# Altium schematic sheet Booster_RF_CH_SUP_CTRL.SchDoc: Booster RF channel
size 420 x 297 mm; Author: G.K.; CompanyName: WUT; DrawnBy: G.K.; Organization: CERN; Address1: Warsaw Univeristy of Technology; Address2: Nowowiejska 15/19; Revision: 1.6.1; SheetNumber: -; SheetTotal: -; EDA_Number: ARTIQ; Projet: ADC/DAC MEZZANINE; ModifiedBy: -; CreateDate: XX/XX/XXXX; CheckedDate: -; Title2: supply & control v1.6; DivGrp: ISE; Designer: G.K.; ModifiedDate: -; ProjectName: ADC/DAC MEZZANINE
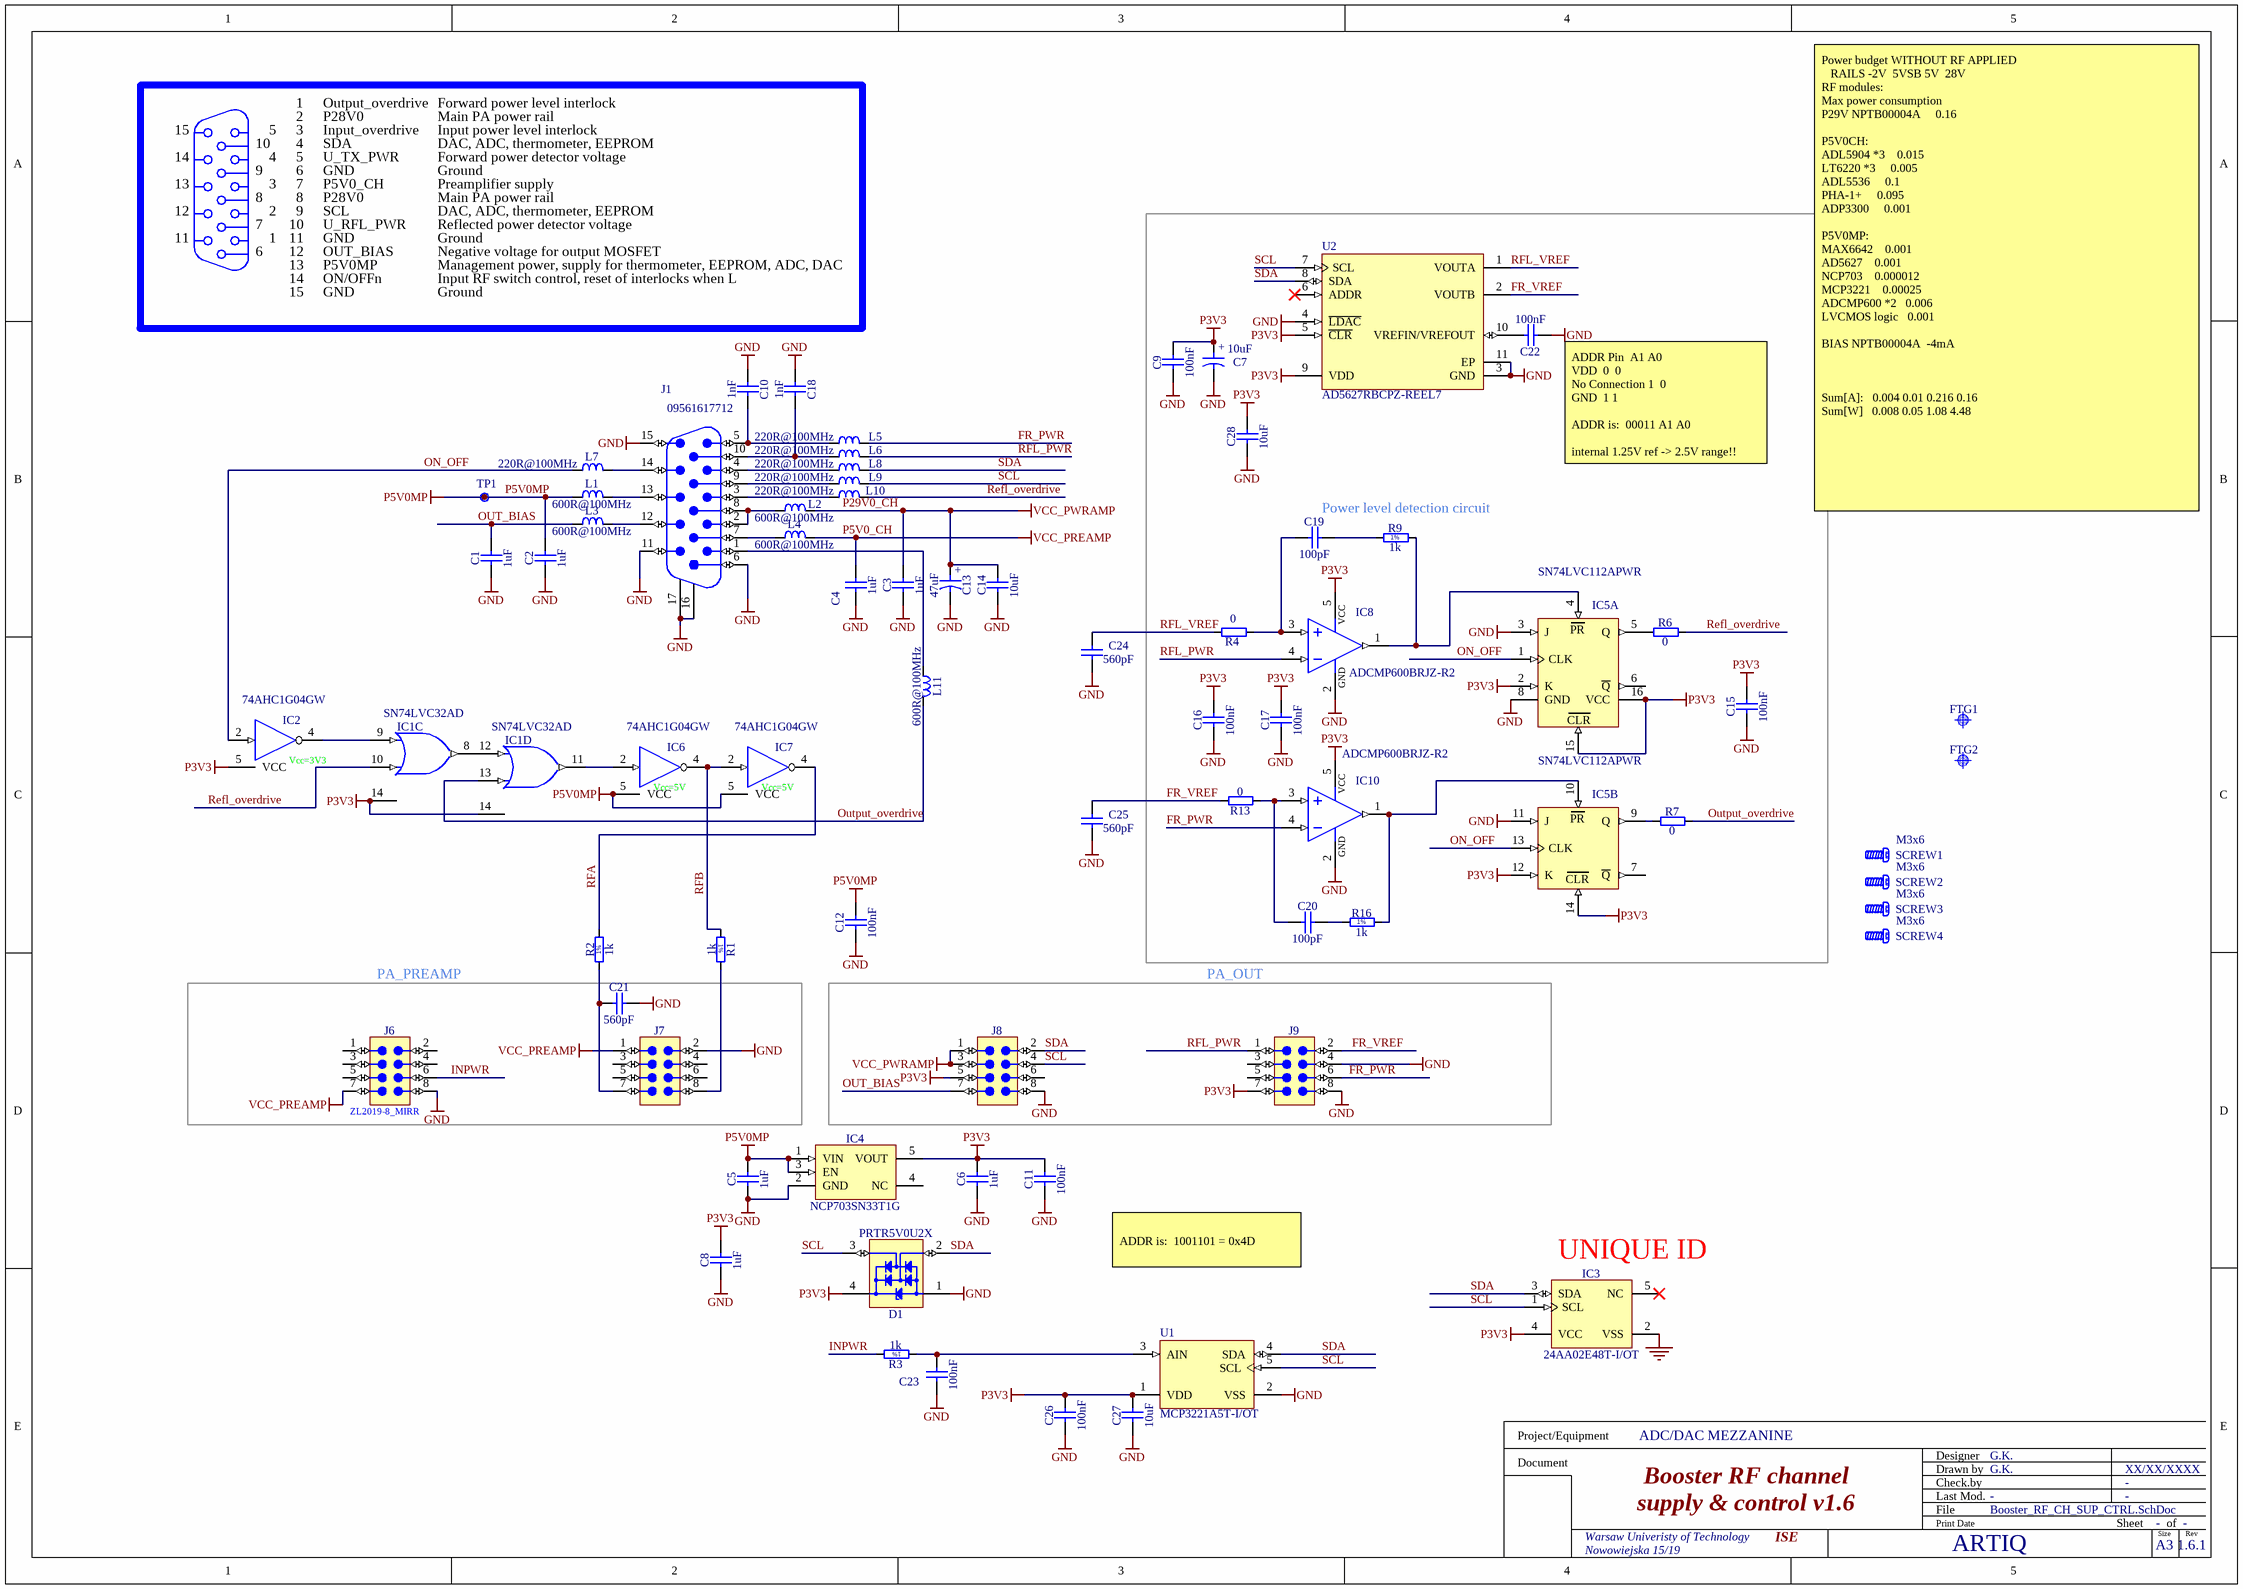
[diagram p0: Booster_RF_CH_SUP_CTRL.SchDoc]

## Parts
C1  1uF  [CAPC2012X110N]
C2  1uF  [CAPC2012X110N]
C3  1uF  [CAPC2012X110N]
C4  1uF  [CAPC2012X110N]
C5  1uF  [CAPC2012X140N]
C6  1uF  [CAPC2012X140N]
C7  10uF  [CAPMP3216X180N]
C8  1uF  [CAPC2012X140N]
C9  100nF  [CAPC1005X55N]
C10  1nF  [CAPC1608X90N]
C11  100nF  [CAPC1005X55N]
C12  100nF  [CAPC1005X55N]
C13  47uF  [CAPMP7343X430N]
C14  10uF  [CAPC3216X190N]
C15  100nF  [CAPC1005X55N]
C16  100nF  [CAPC1005X55N]
C17  100nF  [CAPC1005X55N]
C18  1nF  [CAPC1608X90N]
C19  100pF  [CAPC1005X55N]
C20  100pF  [CAPC1005X55N]
C21  560pF  [CAPC1608X87N]
C22  100nF  [CAPC1005X55N]
C23  100nF  [CAPC1005X55N]
C24  560pF  [CAPC1608X87N]
C25  560pF  [CAPC1608X87N]
C26  100nF  [CAPC1005X55N]
C27  10uF  [CAPC3216X190N]
C28  10uF  [CAPC3216X190N]
D1  PRTR5V0U2X  [SOT190P230X110-4N]
FTG1  Use only in PCB  [FIDUCIAL_TOP_C100-200]  (value not drawn)  (no BOM)
FTG2  Use only in PCB  [FIDUCIAL_TOP_S100-200]  (value not drawn)  (no BOM)
IC1  SN74LVC32AD  [SOIC127P600X175-14N]  (parts C,D of 4)
IC2  74AHC1G04GW  [SOT65P212X110-5N]
IC3  24AA02E48T-I/OT  [SOT95P280X145-5N]
IC4  NCP703SN33T1G  [SOT95P275X110-5N]
IC5  SN74LVC112APWR  [SOP65P640X120-16N]  (parts A,B of 2)
IC6  74AHC1G04GW  [SOT65P212X110-5N]
IC7  74AHC1G04GW  [SOT65P212X110-5N]
IC8  ADCMP600BRJZ-R2  [SOT95P280X145-5N]
IC10  ADCMP600BRJZ-R2  [SOT95P280X145-5N]
J1  Manufacturer Part Number: 09561617712  [TYCO_5750489-1]  (hidden comment: HD-Sub)
J6  Header 8  [ZL2019-8_MIRR]  (value not drawn)
J7  Header 8  [ZL2019-8_MIRR]  (value not drawn)
J8  Header 8  [ZL2019-8_MIRR]  (value not drawn)
J9  Header 8  [ZL2019-8_MIRR]  (value not drawn)
L1  600R@100MHz  [INDC3216X130N]
L2  600R@100MHz  [INDC3216X130N]
L3  600R@100MHz  [INDC3216X130N]
L4  600R@100MHz  [INDC3216X130N]
L5  220R@100MHz  [INDC1005X55N]
L6  220R@100MHz  [INDC1005X55N]
L7  220R@100MHz  [INDC1005X55N]
L8  220R@100MHz  [INDC1005X55N]
L9  220R@100MHz  [INDC1005X55N]
L10  220R@100MHz  [INDC1005X55N]
L11  600R@100MHz  [INDC3216X130N]
R1  1k  [RESC1005X40N]
R2  1k  [RESC1005X40N]
R3  1k  [RESC1005X40N]
R4  0  [RESC1005X40N]
R6  0  [RESC1608X55N]
R7  0  [RESC1608X55N]
R9  1k  [RESC1005X40N]
R13  0  [RESC1005X40N]
R16  1k  [RESC1005X40N]
SCREW1  M3x6  [BOSSARD_BN5687-3061605_v]
SCREW2  M3x6  [BOSSARD_BN5687-3061605_v]
SCREW3  M3x6  [BOSSARD_BN5687-3061605_v]
SCREW4  M3x6  [BOSSARD_BN5687-3061605_v]
TP1  Test Point  [TPS127]  (value not drawn)  (no BOM)
U1  MCP3221A5T-I/OT  [SOT-23-OT5_L]
U2  AD5627RBCPZ-REEL7  [CP-10-9_M]

## Blocks framed on the sheet
Power level detection circuit: C7 C9 C15-C17 C19 C20 C22 C28 IC5 IC8 IC10 R4 R6 R7 R9 R13 R16 U2
PA_PREAMP: C21 J6 J7
PA_OUT: J8 J9

## Nets
GND: C1.1 C2.1 C3.1 C4.1 C5.1 C6.1 C7.2 C8.1 C9.1 C10.1 C11.1 C12.1 C13.2 C14.1 C15.1 C16.1 C17.1 C18.1 C21.2 C22.1 C23.1 C24.2 C25.2 C26.1 C27.1 C28.1 D1.1(GND) IC1.7(GND) IC2.3(GND) IC3.2(VSS) IC4.2(GND) IC5.3(J) IC5.8(GND) IC5.11(J) IC6.3(GND) IC7.3(GND) IC8.2(GND) IC10.2(GND) J1.6 J1.11 J1.15 J1.16 J1.17 J6.8 J7.2 J8.8 J9.4 J9.8 U1.2(VSS) U2.3(GND) U2.4(~{LDAC}) U2.11(EP)
P3V3: C6.2 C7.1 C8.2 C9.2 C11.2 C15.2 C16.2 C17.2 C26.2 C27.2 C28.2 D1.4(VCC) IC1.14(VCC) IC2.5(VCC) IC3.4(VCC) IC4.5(VOUT) IC5.2(K) IC5.12(K) IC5.14(~{CLR}) IC5.15(~{CLR}) IC5.16(VCC) IC8.5(VCC) IC10.5(VCC) J8.5 J9.7 U1.1(VDD) U2.5(~{CLR}) U2.9(VDD)
P5V0_CH: C4.2 J6.7 J7.1 L4.2  [also labelled VCC_PREAMP]
P5V0MP: C2.2 C5.2 C12.2 IC4.1(VIN) IC4.3(EN) IC6.5(VCC) IC7.5(VCC) L1.1 TP1.1
P29V0_CH: C3.2 C13.1 C14.2 J8.1 J8.3 L2.2  [also labelled VCC_PWRAMP]
FR_PWR: IC10.4(VN) J9.6 L5.2
FR_VREF: C25.1 J9.2 R13.2 U2.2(VOUTB)
INPWR: J6.6 R3.2
ON_OFF: IC2.2(IN) IC5.1(CLK) IC5.13(CLK) L7.1
OUT_BIAS: C1.2 J8.7 L3.1
Output_overdrive: IC1.13(B) L11.2 R7.2
Refl_overdrive: IC1.10(B) L10.2 R6.2
RFA: IC7.4(OUT) R2.2
RFB: IC6.4(OUT) IC7.2(IN) R1.1
RFL_PWR: IC8.4(VN) J9.1 L6.2
RFL_VREF: C24.1 R4.2 U2.1(VOUTA)
SCL: D1.3(I/O2) IC3.1(SCL) J8.4 L9.2 U1.5(SCL) U2.7(SCL)
SDA: D1.2(I/O1) IC3.3(SDA) J8.2 L8.2 U1.4(SDA) U2.8(SDA)
NetC10_2: C10.2 J1.5 L5.1
NetC18_2: C18.2 J1.10 L6.1
NetC19_1: C19.1 IC8.3(VP) R4.1
NetC19_2: C19.2 R9.1
NetC20_1: C20.1 IC10.3(VP) R13.1
NetC20_2: C20.2 R16.1
NetC21_1: C21.1 J7.7 R2.1
NetC22_2: C22.2 U2.10(VREFIN/VREFOUT)
NetC23_2: C23.2 R3.1 U1.3(AIN)
NetIC1_8: IC1.8(Y) IC1.12(A)
NetIC1_9: IC1.9(A) IC2.4(OUT)
NetIC1_11: IC1.11(Y) IC6.2(IN)
NetIC5_4: IC5.4(~{PRE}) IC8.1(q) R9.2
NetIC5_5: IC5.5(Q) R6.1
NetIC5_9: IC5.9(Q) R7.1
NetIC5_10: IC5.10(~{PRE}) IC10.1(q) R16.2
NetJ1_1: J1.1 L11.1
NetJ1_2: J1.2 J1.8 L2.1
NetJ1_3: J1.3 L10.1
NetJ1_4: J1.4 L8.1
NetJ1_7: J1.7 L4.1
NetJ1_9: J1.9 L9.1
NetJ1_12: J1.12 L3.2
NetJ1_13: J1.13 L1.2
NetJ1_14: J1.14 L7.2
NetJ7_8: J7.8 R1.2

Not connected (* = marked no-connect by the designer): IC3 5(NC)*; IC4 4(NC); IC5 6(~{Q}) 7(~{Q}); J6 1 2 3 4 5; J7 3 4 5 6; J8 6; J9 3 5; U2 6(ADDR)*

## Notes on the sheet
- 1
- 2
- Output_overdrive
- P28V0
- Forward power level interlock
- Main PA power rail
- 13
- 14
- 15
- 9
- 10
- 3
- 4
- 5
- 6
- 7
- Input_overdrive
- SDA
- U_TX_PWR
- GND
- P5V0_CH
- Input power level interlock
- DAC, ADC, thermometer, EEPROM
- Forward power detector voltage
- Preamplifier supply
- Ground
- 11
- 12
- 8
- SCL
- U_RFL_PWR
- OUT_BIAS
- Reflected power detector voltage
- Negative voltage for output MOSFET
- ON/OFFn
- P5V0MP
- Input RF switch control, reset of interlocks when L
- Management power, supply for thermometer, EEPROM, ADC, DAC
- (near C22) ADDR Pin		A1	A0
  VDD		0 	0
  No Connection	1 	0
  GND		1	1
  ADDR is:  00011 A1 A0
  internal 1.25V ref -> 2.5V range!!
- Power budget WITHOUT RF APPLIED
  RAILS	-2V 	5VSB	5V 	28V
  RF modules:
  Max power consumption
  P29V NPTB00004A					0.16
  P5V0CH:
  ADL5904 *3				0.015
  LT6220 *3					0.005
  ADL5536					0.1
  PHA-1+					0.095
  ADP3300					0.001
  P5V0MP:
  MAX6642				0.001
  AD5627				0.001
  NCP703				0.000012
  MCP3221				0.00025
  ADCMP600 *2			0.006
  LVCMOS logic			0.001
  BIAS NPTB00004A		-4mA
  Sum[A]:			0.004	0.01	0.216	0.16
  Sum[W]			0.008	0.05	1.08	4.48
- (near IC2) Vcc=3V3
- (near IC6) Vcc=5V
- (near IC7) Vcc=5V
- (near J6) ZL2019-8_MIRR
- ADDR is:  1001101 = 0x4D
- (near IC3) UNIQUE ID
- Project/Equipment
- Document
- Designer
- Drawn by
- Check.by
- File
- Last Mod.
- Print Date
- Sheet
- Size
- A3
- of
- Rev
- (in symbol 74LVC112APWR, part A) PR; CLR
- (in symbol 74LVC112APWR, part B) PR; CLR
- (in symbol CTE3216-18_10UF_16V_20%_AVX_TCJ) +
- (in symbol CTE7343-43_47UF_35V_10%_LESR0300) +
- (in symbol R0402_1K_1%_0.0625W_100PPM) 1%

## Library data of the parts
C1-C4 = CC0805_1UF_50V_10%_X7R: Non-polarised capacitor; Part Description: SMD Multilayer Chip Ceramic Capacitor; Manufacturer: GENERIC; Manufacturer1 Part Number: C0805C105K5RACTU; Voltage: 50V; TC: X7R; Tolerance: ±10%; Part Number: CC0805_1UF_50V_10%_X7R; Component Kind: Standard; Component Type: Standard; Pin Count: 2; Value: 1uF; Status: Preferred; Manufacturer Part Number: CC0805_1UF_50V_10%_X7R; Case: 0805; Mounted: Yes; Socket: No; SMD: Yes; Sense: No; Manufacturer1 Example: KEMET; Manufacturer1 ComponentHeight: 1.1mm; HelpURL: \\cern.ch\dfs\Applications\Altium\Datasheets\CC0805_X7R_KEMET.pdf; Author: CERN DEM JLC; CreateDate: 04.12.2013; LatestRevisionDate: 04.12.2013
C5 C6 C8 = CC0805_1UF_35V_20%_X7R: Non-polarised capacitor; Part Description: SMD Multilayer Chip Ceramic Capacitor; Manufacturer: GENERIC; Manufacturer1 Part Number: GMK212B7105MG-T; Voltage: 35V; TC: X7R; Tolerance: ±20%; Part Number: CC0805_1UF_35V_20%_X7R; Component Kind: Standard; Component Type: Standard; Pin Count: 2; Value: 1uF; Status: Not Recommended; Manufacturer Part Number: CC0805_1UF_35V_20%_X7R; Case: 0805; Mounted: Yes; Socket: No; SMD: Yes; Sense: No; Manufacturer1 Example: TAIYO YUDEN; Manufacturer1 ComponentHeight: 1.35mm; HelpURL: \\cern.ch\dfs\Applications\Altium\Datasheets\CC0805_X7R_TAIYO-YUDEN_HIGH-VALUE.pdf; Author: CERN DEM JLC; CreateDate: 22.06.2011; LatestRevisionDate: 22.06.2011
C7 = CTE3216-18_10UF_16V_20%_AVX_TCJ: Polarised capacitor; Part Description: ESR 0R200 Tantalum Solid Electrolytic Chip Capacitor with Conductive Polymer Electrode; Manufacturer: AVX; Manufacturer Part Number: TCJA106M016R0200; Voltage: 16V; Tolerance: ±20%; Part Number: CTE3216-18_10UF_16V_20%_AVX_TCJ; Component Kind: Standard; Component Type: Standard; Pin Count: 2; Value: 10uF; Status: Preferred; Case: A; Mounted: Yes; Socket: No; SMD: Yes; Sense: No; ComponentHeight: 1.8mm; HelpURL: \\cern.ch\dfs\Applications\Altium\Datasheets\CTE_AVX_TCJ.pdf; Author: CERN DEM JLC; CreateDate: 29.03.2012; LatestRevisionDate: 29.03.2012
C9 C11 C12 C15-C17 C22 C23 C26 = CC0402_100NF_16V_10%_X5R: Non-polarised capacitor; Part Description: SMD Multilayer Chip Ceramic Capacitor; Manufacturer: GENERIC; Manufacturer1 Part Number: GRM155R61C104KA88D; Voltage: 16V; TC: X5R; Tolerance: ±10%; Part Number: CC0402_100NF_16V_10%_X5R; Component Kind: Standard; Component Type: Standard; Pin Count: 2; Value: 100nF; Status: None; Manufacturer Part Number: CC0402_100NF_16V_10%_X5R; Case: 0402; Mounted: Yes; Socket: No; SMD: Yes; Sense: No; Manufacturer1 Example: MURATA; Manufacturer1 ComponentHeight: 0.55mm; HelpURL: \\cern.ch\dfs\Applications\Altium\Datasheets\CC0402_X5R_MURATA_GRM.pdf; Author: CERN DEM JLC; CreateDate: 10.12.2013; LatestRevisionDate: 10.12.2013
C10 C18 = CC0603_1NF_50V_1%_NP0: Non-polarised capacitor; Part Number: CC0603_1NF_50V_5%_NP0; Part Description: SMD Multilayer Chip Ceramic Capacitor; Manufacturer: GENERIC; Manufacturer1 Part Number: 06035A102FAT2A; Voltage: 50V; TC: C0G/NP0; Tolerance: ±5%; Component Kind: Standard; Component Type: Standard; Pin Count: 2; Value: 1nF; Status: None; Manufacturer Part Number: CC0603_1NF_50V_5%_NP0; Case: 0603; Mounted: Yes; Socket: No; SMD: Yes; Sense: No; Manufacturer1 Example: AVX; Manufacturer1 ComponentHeight: 0.9mm; HelpURL: \\cern.ch\dfs\Applications\Altium\Datasheets\CC0603_C0G_AVX.pdf; Author: CERN DEM JLC; CreateDate: 15/06/2017; LatestRevisionDate: 15/06/2017
C13 = CTE7343-43_47UF_35V_10%_LESR0300: Polarised capacitor; Part Description: ESR 0R3 Solid Tantalum Chip Capacitor; Manufacturer: GENERIC; Manufacturer1 Part Number: T495X476K035ATE300; Voltage: 35V; Tolerance: ±10%; Part Number: CTE7343-43_47UF_35V_10%_LESR0300; Component Kind: Standard; Component Type: Standard; Pin Count: 2; Value: 47uF; Status: Preferred; Manufacturer Part Number: CTE7343-43_47UF_35V_10%_LESR0300; Case: E; Mounted: Yes; Socket: No; SMD: Yes; Sense: No; Manufacturer1 Example: AVX; Manufacturer1 ComponentHeight: 4.3mm; HelpURL: \\cern.ch\dfs\Applications\Altium\Datasheets\CTEB_KEMET_T495.pdf; Author: CERN DEM JLC; CreateDate: 27.05.2013; LatestRevisionDate: 27.05.2013
C14 C27 C28 = CC1206_10UF_50V_10%_X5R_TDK_CGA5L3X5R1H106K160AB: Non-polarised capacitor; Part Description: SMD Multilayer Chip Ceramic Capacitor (Automotive Grade); Manufacturer: TDK; Voltage: 50V; TC: X5R; Tolerance: ±10%; Part Number: CC1206_10UF_50V_10%_X5R_TDK_CGA5L3X5R1H106K160AB; Component Kind: Standard; Component Type: Standard; Pin Count: 2; Value: 10uF; Status: Not Recommended; Manufacturer Part Number: CGA5L3X5R1H106K160AB; Case: 1206; Mounted: Yes; Socket: No; SMD: Yes; Sense: No; ComponentHeight: 1.9mm; HelpURL: \\cern.ch\dfs\Applications\Altium\Datasheets\CC1206_X5R_TDK_CGA.pdf; Author: CERN DEM BC; CreateDate: 29.02.2016; LatestRevisionDate: 13.09.2016
C19 C20 = CC0402_100PF_50V_5%_C0G: Non-polarised capacitor; Part Description: SMD Multilayer Chip Ceramic Capacitor; Manufacturer: GENERIC; Manufacturer1 Part Number: C0402C101J5GACTU; Voltage: 50V; TC: C0G/NP0; Tolerance: ±5%; Part Number: CC0402_100PF_50V_5%_C0G; Component Kind: Standard; Component Type: Standard; Pin Count: 2; Value: 100pF; Status: Preferred; Manufacturer Part Number: CC0402_100PF_50V_5%_C0G; Case: 0402; Mounted: Yes; Socket: No; SMD: Yes; Sense: No; Manufacturer1 Example: KEMET; Manufacturer1 ComponentHeight: 0.55mm; HelpURL: \\cern.ch\dfs\Applications\Altium\Datasheets\CC0805_C0G_KEMET_(Commercial Grade).pdf; Author: CERN DEM JLC; CreateDate: 03.12.2007; LatestRevisionDate: 22.04.2015
C21 C24 C25 = CC0603_560PF_50V_5%_NP0: Non-polarised capacitor; Part Description: SMD Multilayer Chip Ceramic Capacitor; Manufacturer: GENERIC; Manufacturer1 Part Number: 223886715561; Voltage: 50V; TC: C0G/NP0; Tolerance: ±5%; Part Number: CC0603_560PF_50V_5%_NP0; Component Kind: Standard; Component Type: Standard; Pin Count: 2; Value: 560pF; Status: Preferred; Manufacturer Part Number: CC0603_560PF_50V_5%_NP0; Case: 0603; Mounted: Yes; Socket: No; SMD: Yes; Sense: No; Manufacturer1 Example: PHYCOMP; Manufacturer1 ComponentHeight: 0.87mm; HelpURL: \\cern.ch\dfs\Applications\Altium\Datasheets\CC0603_NP0_PHYCOMP.pdf; Author: CERN DEM JLC; CreateDate: 03.12.2007; LatestRevisionDate: 03.12.2007
D1 = PRTR5V0U2X: Ultra Low Capacitance Double Rail-to-Rail ESD Protection Diode; Part Description: Ultra Low Capacitance (1pF) Double Rail-to-Rail ESD Protection Diode (8kV); Manufacturer: NXP SEMICONDUCTORS; Voltage: 5.5V; PressFit: No; Bonding: No; Part Number: PRTR5V0U2X; Component Kind: Standard; Component Type: Standard; Device: PRTR5V0U2X; PackageDescription: SOT143B, SOT, 1.90mm Pitch; 4 Pin, 1.30mm W X 2.90mm L X 1.10mm H body, IPC Medium Density; Manufacturer Part Number: PRTR5V0U2X; Pin Count: 4; Case: SOT143B; Mounted: Yes; Socket: No; SMD: Yes; Sense: No; ComponentHeight: 1.1mm; HelpURL: \\cern.ch\dfs\Applications\Altium\Datasheets\PRTR5V0U2X.pdf; Author: CERN DEM JLC; CreateDate: 22.03.2011; LatestRevisionDate: 22.03.2011
FTG1 = FIDUCIAL_TARGET_C100-200: Fiducial Target; Part Description: Round Fiducial Target, Top Layer, 1.0mm, Top Solder 2.0mm, Keepout =2.0mm; Mounted: No; Part Number: FIDUCIAL_TARGET_C100-200; Component Type: Standard (No BOM); Pin Count: 1; Family: Fiducial; Socket: No; SMD: Yes; Sense: No; Status: None; ComponentHeight: 0mm; HelpURL: Undefined; Author: CERN DEM JLC; CreateDate: 09.02.2010; LatestRevisionDate: 04.04.2012; PackageDescription: Round Fiducial Target, Top Layer, 1.0mm, Top Solder 2.0mm, Keepout =2.0mm
FTG2 = FIDUCIAL_TARGET_S100-200: Fiducial Target; Part Description: Square Fiducial Target, Top Layer, 1.0mm, Top Solder 2.0mm, Keepout =2.0mm; Mounted: No; Part Number: FIDUCIAL_TARGET_S100-200; Component Type: Standard (No BOM); Pin Count: 1; Family: Fiducial; Socket: No; SMD: Yes; Sense: No; Status: None; ComponentHeight: 0mm; HelpURL: Undefined; Author: CERN DEM JLC; CreateDate: 09.02.2010; LatestRevisionDate: 04.04.2012; PackageDescription: Square Fiducial Target, Top Layer, 1.0mm, Top Solder 2.0mm, Keepout =2.0mm
IC1 = SN74LVC32AD: Quad 2-Input OR Gate; Part Description: Quad 2-Input Positive-OR Gate; Manufacturer: TEXAS INSTRUMENTS; PressFit: No; Bonding: No; Part Number: SN74LVC32AD; Component Kind: Standard; Component Type: Standard; Device: SN74LVC32AD; PackageDescription: SOIC 14, Pitch 1.27mm - Body 4x8.75mm, IPC Medium Density; Manufacturer Part Number: SN74LVC32AD; Pin Count: 14; Case: SOIC14; Mounted: Yes; Socket: No; SMD: Yes; Sense: No; ComponentHeight: 1.75mm; Author: CERN DEM JLC; HelpURL: \\cern.ch\dfs\Applications\Altium\Datasheets\SN74LVC32AD.pdf; CreateDate: 21.03.2012; LatestRevisionDate: 21.03.2012
IC2 IC6 IC7 = 74AHC1G04GW: Single Inverter Buffer; Manufacturer: NXP SEMICONDUCTORS; PressFit: No; Bonding: No; Part Number: 74AHC1G04GW; Component Kind: Standard; Component Type: Standard; Device: 74AHC1G04GW; PackageDescription: SOT353, SOT, 0.65mm Pitch, 5 pin, 1.25mm W X 2.05mm L X 1.10mm H, IPC Medium Density; Part Description: Single Inverter Buffer; Manufacturer Part Number: 74AHC1G04GW; Pin Count: 3; Case: SOT353; Mounted: Yes; Socket: No; SMD: Yes; Sense: No; ComponentHeight: 1.1mm; Author: CERN DEM JLC; HelpURL: \\cern.ch\dfs\Applications\Altium\Datasheets\74AHC1G04GW.pdf; CreateDate: 03.03.2010; LatestRevisionDate: 03.03.2010
IC3 = 24AA02E48T-I/OT: 1.7V-5.5V, 2K I2C Serial EEPROM With EUI-48 Node Identity; Manufacturer: MICROCHIP TECHNOLOGY; PressFit: No; Bonding: No; Part Number: 24AA02E48T-I/OT; Component Kind: Standard; Component Type: Standard; Device: 24AA02E48T-I/OT; PackageDescription: SOT, 0.95mm pitch; 5 pin, 1.60mm W X 2.90mm L X 1.45mm H body, IPC Medium Density; Part Description: 1.7V-5.5V, 2K I2C Serial EEPROM With EUI-48 Node Identity; Manufacturer Part Number: 24AA02E48T-I/OT; Pin Count: 5; Case: SOT23-5; Mounted: Yes; Socket: No; SMD: Yes; Sense: No; ComponentHeight: 1.45mm; HelpURL: \\cern.ch\dfs\Applications\Altium\Datasheets\24AA02E48T-I-OT.pdf; Author: CERN DEM MR; CreateDate: 2016-03-31; LatestRevisionDate: 2016-03-31
IC4 = NCP703SN33T1G: 3.3V 300mA, Ultra-Low Quiescent Current, IQ 12uA, Ultra-Low Noise, LDO Voltage Regulator; Manufacturer: ON SEMICONDUCTOR; PressFit: No; Bonding: No; Part Number: NCP703SN33T1G; Component Kind: Standard; Component Type: Standard; Device: NCP703SN33T1G; PackageDescription: SOT, 0.95mm Pitch; 5 Pin, 1.50mm W X 3.00mm L X 1.10mm H Body, IPC Medium Density; Part Description: 3.3V 300mA, Ultra-Low Quiescent Current, IQ 12uA, Ultra-Low Noise, LDO Voltage Regulator; Manufacturer Part Number: NCP703SN33T1G; Pin Count: 5; Case: SOT23-5; Mounted: Yes; Socket: No; SMD: Yes; Sense: No; ComponentHeight: 1.1mm; HelpURL: \\cern.ch\dfs\Applications\Altium\Datasheets\NCP703SN33T1G.pdf; Author: CERN DEM JLC; CreateDate: 16.02.2017; LatestRevisionDate: 16.02.2017
IC5 = 74LVC112APWR: Dual Negative-Edge-Triggered J-K Flip-Flop With Clear And Preset; Part Description: Dual Negative-Edge-Triggered J-K Flip-Flops With Clear and Preset; Manufacturer: TEXAS INSTRUMENTS; PressFit: No; Bonding: No; Part Number: SN74LVC112APWR; Component Kind: Standard; Component Type: Standard; Device: SN74LVC112APWR; PackageDescription: SOP, 0.65mm Pitch; 16 Pin, 4.40mm W X 5.00mm L X 1.20mm H Body, IPC Medium Density; Manufacturer Part Number: SN74LVC112APWR; Pin Count: 16; Case: TSSOP16; Mounted: Yes; Socket: No; SMD: Yes; Sense: No; ComponentHeight: 1.75mm; Author: CERN DEM JLC; HelpURL: \\cern.ch\dfs\Applications\Altium\Datasheets\SN74LS112AD.pdf; CreateDate: 06.08.2012; LatestRevisionDate: 06.08.2012
IC8 IC10 = ADCMP600BRJZ-R2: Rail-to-Rail, Very Fast, 2.5 V to 5.5 V Single-Supply TTL/CMOS Comparator; Manufacturer: ANALOG DEVICES; PressFit: No; Bonding: No; Part Number: ADCMP600BRJZ-R2; Component Kind: Standard; Component Type: Standard; Device: ADCMP600BRJZ-R2; PackageDescription: SOT, 0.95mm pitch; 5 pin, 1.60mm W X 2.90mm L X 1.45mm H body, IPC Medium Density; Part Description: Rail-to-Rail, Very Fast, 2.5 V to 5.5 V Single-Supply TTL/CMOS Comparator; Manufacturer Part Number: ADCMP600BRJZ-R2; Pin Count: 5; Case: SOT23-5; Mounted: Yes; Socket: No; SMD: Yes; Sense: No; ComponentHeight: 1.45mm; Author: CERN DEM JLC; HelpURL: \\cern.ch\dfs\Applications\Altium\Datasheets\ADCMP600BRJZ-R2.pdf; CreateDate: 25/04/2012; LatestRevisionDate: 25/04/2012
J1 = CON_DB15_V_M_5750489-1: Connector High Density D-sub 15 Male; Part Number: HARTING_09561617712; Part Description: 15 Male Contacts, Straight High Density D-SUB Connector, AMPLIMITE HD-22 Serie; Manufacturer: HARTING Elektronik; PressFit: No; Component Kind: Standard; Component Type: Standard; Pin Count: 17; Family: HD-Sub; Mounted: Yes; Socket: No; SMD: No; Sense: No; Status: None; ComponentHeight: 12.75mm; HelpURL: \\cern.ch\dfs\Applications\Altium\Datasheets\TYCO_1-1734530-1.pdf; Author: GK; CreateDate: 26.06.2013; LatestRevisionDate: 26.06.2013
J6-J9 = CON_2x4 2.54 male MIRROR: Connector 8 Male; Part Number: ZL2019-8; Part Description: 8 Contacts, Pitch 2.54mm, Dual Row  Through Mount Straight Header (Post Lead 5.84mm, Tail Lead 2.92mm, Insulator 2.54mm); Manufacturer: NINIGI; PressFit: No; Component Kind: Standard; Component Type: Standard; Pin Count: 8; Family: Header 8; Mounted: Yes; Socket: No; Sense: No; SMD: No; Status: None; Manufacturer Part Number: ZL2019-8; ComponentHeight: 19.4; HelpURL: \\cern.ch\dfs\Applications\Altium\Datasheets\SAMTEC_TSW-104-23-L-D.pdf; Author: GK; CreateDate: 08.03.2017; LatestRevisionDate: 08.03.2017
L1-L4 L11 = IND1206_WURTH_74279218: Inductor; Part Description: SMD EMI Suppression Chip Ferrite Bead (WE-CBF Series); Manufacturer: WURTH ELEKTRONIK; Power: 2A; Resistance: 0.1R; Tolerance: ±25%; Part Number: IND1206_WURTH_74279218; Component Kind: Standard; Component Type: Standard; Pin Count: 2; Value: 600R@100MHz; Status: None; Manufacturer Part Number: 74279218; Case: 1206; Mounted: Yes; Socket: No; SMD: Yes; Sense: No; ComponentHeight: 1.3mm; HelpURL: \\cern.ch\dfs\Applications\Altium\Datasheets\IND1206_WURTH_74279218.pdf; Author: CERN DEM JLC; CreateDate: 24.01.2012; LatestRevisionDate: 24.01.2012
L5-L10 = IND0402_MURATA_BLM15HB221SN1: Inductor; Part Description: SMD EMIFIL Suppression Chip Ferrite Bead; Manufacturer: MURATA; Power: 250mA; Resistance: 1R; Tolerance: ±25%; Part Number: IND0402_MURATA_BLM15HB221SN1; Component Kind: Standard; Component Type: Standard; Pin Count: 2; Value: 220R@100MHz; Status: None; Manufacturer Part Number: BLM15HB221SN1; Case: 0402; Mounted: Yes; Socket: No; SMD: Yes; Sense: No; ComponentHeight: 0.55mm; HelpURL: \\cern.ch\dfs\Applications\Altium\Datasheets\IND0402_MURATA_BLM15H.pdf; Author: CERN DEM JLC; CreateDate: 23.06.2009; LatestRevisionDate: 23.06.2009
R1-R3 R9 R16 = R0402_1K_1%_0.0625W_100PPM: Resistor - 1%; Part Description: General Purpose Thick Film Chip Resistor; Manufacturer: GENERIC; Manufacturer1 Part Number: 232270671002L; TC: ±100ppm/°C; PressFit: No; Part Number: R0402_1K_1%_0.0625W_100PPM; Component Kind: Standard; Component Type: Standard; Pin Count: 2; Value: 1k; Status: Not Recommended; Power: 0.0625W; Tolerance: ±1%; Manufacturer Part Number: R0402_1K_1%_0.0625W_100PPM; Case: 0402; Mounted: Yes; Sense: No; Socket: No; SMD: Yes; Manufacturer1 Example: YAGEO PHYCOMP; Manufacturer1 ComponentHeight: 0.4mm; HelpURL: \\cern.ch\dfs\Applications\Altium\Datasheets\R0402_Phycomp_RC0402.pdf; Author: CERN DEM JLC
  R1-R3: CreateDate: 03/12/2007; LatestRevisionDate: 17/10/2012
  R9 R16: CreateDate: 03.12.2007; LatestRevisionDate: 17.10.2012
R4 R13 = R0402_0R_JUMPER: Resistor; Part Description: 1A (0.05R Max DC Resistance) Zero Ohm Jumper; Manufacturer: GENERIC; Manufacturer1 Part Number: 232270591001L; Part Number: R0402_0R_JUMPER; Component Kind: Standard; Component Type: Standard; Pin Count: 2; Value: 0; Status: Not recommended; Manufacturer Part Number: R0402_0R_JUMPER; Case: 0402; Mounted: Yes; Sense: No; Socket: No; SMD: Yes; Manufacturer1 Example: YAGEO PHYCOMP; Manufacturer1 ComponentHeight: 0.4mm; HelpURL: \\cern.ch\dfs\Applications\Altium\Datasheets\R0402_Phycomp_RC0402.pdf; Author: CERN DEM JLC; CreateDate: 03.12.2007; LatestRevisionDate: 17.10.2012
R6 R7 = R0603_0R_JUMPER: Resistor; Part Description: 1A (0.05R Max DC Resistance) Zero Ohm Jumper; Manufacturer: GENERIC; Manufacturer1 Part Number: NRC06Z0; PressFit: No; Part Number: R0603_0R_JUMPER; Component Kind: Standard; Component Type: Standard; Pin Count: 2; Value: 0; Status: Preferred; Manufacturer Part Number: R0603_0R_JUMPER; Case: 0603; Mounted: Yes; Sense: No; Socket: No; SMD: Yes; Manufacturer1 Example: NIC COMPONENT; Manufacturer1 ComponentHeight: 0.55mm; HelpURL: \\cern.ch\dfs\Applications\Altium\Datasheets\R0603_NIC_NRC.pdf; Author: CERN DEM JLC; CreateDate: 03/12/2007; LatestRevisionDate: 13/03/2008
SCREW1-SCREW4 = BOSSARD_BN5687-3061605_v: Screw; Part Description: M3 L=6mm Hexalobular Socket Pan Head Screw, Fully Threaded, Stainless Steel A2; Manufacturer Part Number: BN5687 Art.3061605; PressFit: No; Part Number: BOSSARD_BN5687-3061605_v; Component Kind: Standard; Component Type: Mechanical; Pin Count: 0; PackageDescription: M3 L=6mm Hexalobular Socket Pan Head Screw, Fully Threaded - Stainless Steel A2; Mounted: Yes; Socket: No; SMD: No; Sense: No; Status: None; Value: M3x6; Manufacturer: BOSSARD; ComponentHeight: 2.4mm; HelpURL: \\cern.ch\dfs\Applications\Altium\Datasheets\BOSSARD_BN5687-3061605.pdf; Author: CERN DEM JLC; CreateDate: 15/01/2013; LatestRevisionDate: 15/01/2013
TP1 = SMD_PAD_1.27X1.27MM: Part Description: 1.27mm x 1.27mm PCB Copper Area (SMD Test Point); Mounted: No; Part Number: SMD_PAD_1.27X1.27MM; Component Type: Standard (No BOM); Pin Count: 1; Family: Test Point; Socket: No; SMD: Yes; Sense: No; Status: None; ComponentHeight: 0mm; HelpURL: Undefined; Author: CERN DEM JLC; CreateDate: 12/01/2008; LatestRevisionDate: 12/01/2008; PackageDescription: 1.27mm x 1.27mm PCB Copper Area (SMD Test Point)
U1 = CMP-0188-00733-2: Low Power 12-Bit A/D Converter With I2C Interface, 5-Pin SOT-23, Industrial Temperature, Tape and Reel; ComponentLink1URL: http://www.microchip.com/; ComponentLink2URL: http://ww1.microchip.com/downloads/en/DeviceDoc/21732c.pdf; PackageVersion: revBB, Aug-2009; PackageDescription: 5-Lead Plastic Small Outline Transistor (OT) [SOT-23]; ComponentLink2Description: Datasheet; ComponentLink1Description: Manufacturer URL; RevisionNote: URLs added.; DatasheetVersion: revC, Jul-2006; PackageReference: SOT-23-OT5; ComponentLink3Description: Package Specification; Code_IPC: SOT23-5; ComponentLink3URL: http://www.microchip.com/stellent/groups/techpub_sg/documents/packagingspec/en012702.pdf; Manufacturer Part Number: MCP3221A5T-I/OT
U2 = CMP-0318-01236-2: Dual 12-Bit nanoDAC with I2C Interface and 5 ppm/degC On-Chip Reference, -40 to +105 degC, CP-10-9, Pb-Free, Reel; Manufacturer: Analog Devices; Op Pwr Diss: 5.75mW; Resolution (Bits): 12; Settling Time: 3Âµs; # DAC Outputs: 2; Single Supply: Yes; Max V+: 5.5V; ComponentLink3URL: http://www.analog.com/static/imported-files/packages/CP_10_9.pdf; ComponentLink1Description: Manufacturer URL; PackageDescription: 10-Lead Lead Frame Chip Scale Package [LFCSP_WD] 3 x 3 mm Body, Very Very Thin, Dual Lead; ComponentLink4URL: http://www.analog.com/en/digital-to-analog-converters/da-converters/ad5627r/products/product.html; Generic Part Number: AD5627R; Packing: Reel; ComponentLink4Description: Product URL; Mounting Technology: Surface Mount; DatasheetVersion: Rev.0; RevisionNote: Component URL fixed; ComponentLink2URL: http://www.analog.com/static/imported-files/data_sheets/AD5627R_5647R_5667R_5627_5667.pdf; ComponentLink1URL: http://www.analog.com/en/index.html; ComponentLink3Description: Package Specification; Manufacturer Part Number: AD5627RBCPZ-REEL7; RoHS: Y; PackageVersion: 02-27-2012-B; ComponentLink2Description: Datasheet; PackageReference: CP-10-9